# Altium schematic sheet Schematic diagram.SchDoc
size A
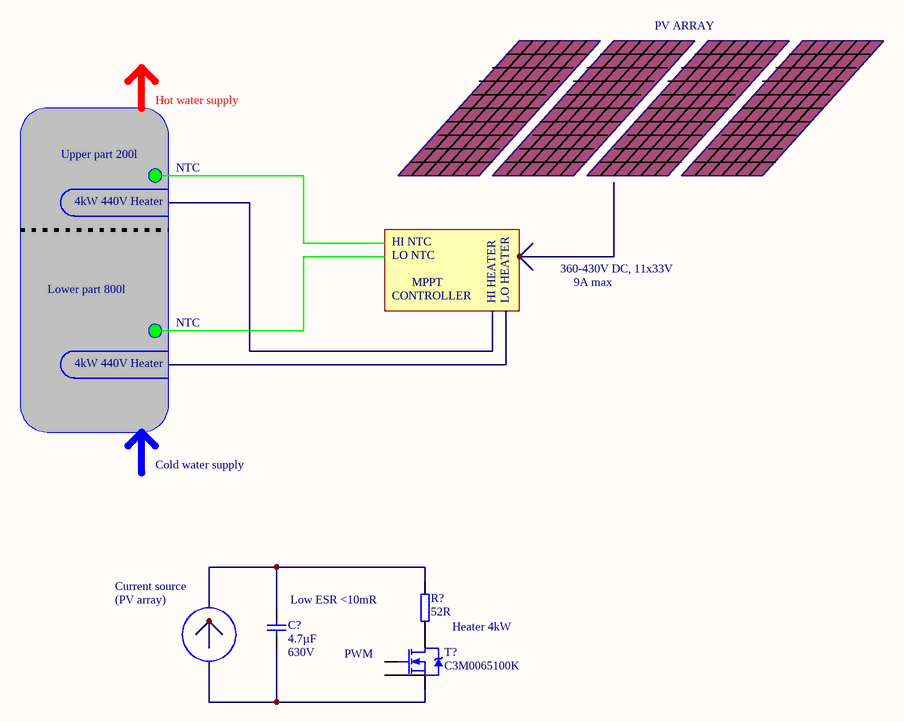
[diagram p0: Schematic diagram.SchDoc]

## Parts
C?  4.7µF  Voltage: 630V  [CAPC2012X135N]
R?  52R  [RESC1005X40N]
T?  C3M0065100K  [TO247-4]

## Nets
NetC?_1: C?.1 R?.2
NetC?_2: C?.2 T?.2(S)
NetR?_1: R?.1 T?.1(D)

Not connected (* = marked no-connect by the designer): T? 3(S) 4(G)

## Notes on the sheet
- PV ARRAY
- Hot water supply
- Upper part 200l
- 4kW 440V Heater
- NTC
- HI NTC
- LO NTC
- Lower part 800l
- CONTROLLER
- MPPT
- HI HEATER
- LO HEATER
- 360-430V DC, 11x33V
- 9A max
- Cold water supply
- Current source
- (PV array)
- (near C?) Low ESR <10mR
- (near T?) PWM
- Heater 4kW

## Library data of the parts
C? = 24718: KON 47µF 6,3V X5R SMD 20%; AN: 24718; Mixed: SMT; Value: 47u; Preferred: Yes; Case: 2012 (0805); Tolerance: 20%
R? = 22738: WID SMD 0R; AN: 22738; Mixed: SMT; Value: 0; Preferred: Yes; Case: 1005 (0402); Technology: TK100
T? = T_C3M0065100K_THT: SiC 1kV 35A N mosfet Rdson 0.07@UGS=15V Qg=35nC; Manufacturer: CREE/wolfspeed; Type: THT; Category: TRANSISTOR; Current: 35A; Manufacturer Part Number: C3M0065100K; Price1k: 13; Price10: 16.5; Supplier: TME; Supplier Part Number: C3M0065100K; Temperature: -55 to + 150 stC; Value: C3M0065100K; Voltage: 1kV; Supplier 1: Farnell; Supplier Part Number 1: 2672013